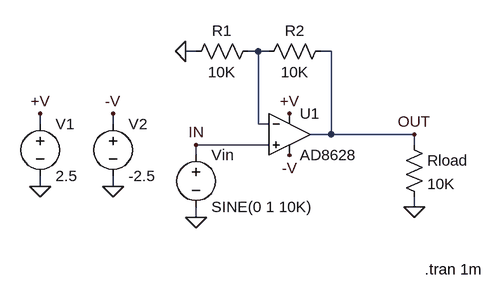
[diagram p0: schematic AD8628.asc]
AD8628.asc, the LTspice schematic file:
Version 4
SHEET 1 1240 700
WIRE -16 -1056 -32 -1056
WIRE 80 -1056 64 -1056
WIRE 96 -1056 80 -1056
WIRE 192 -1056 176 -1056
WIRE -256 -944 -256 -960
WIRE -144 -944 -144 -960
WIRE 80 -944 80 -1056
WIRE 96 -944 80 -944
WIRE 192 -928 192 -1056
WIRE 192 -928 160 -928
WIRE 320 -928 192 -928
WIRE 96 -912 -16 -912
WIRE 320 -912 320 -928
WIRE -16 -896 -16 -912
WIRE -256 -848 -256 -864
WIRE -144 -848 -144 -864
WIRE 320 -816 320 -832
WIRE -16 -800 -16 -816
FLAG -256 -960 +V
FLAG -256 -848 0
FLAG -16 -800 0
FLAG 320 -928 OUT
FLAG -16 -912 IN
FLAG 128 -960 +V
FLAG -144 -960 -V
FLAG 128 -896 -V
FLAG -32 -1056 0
FLAG 320 -816 0
FLAG -144 -848 0
SYMBOL voltage -256 -960 R0
WINDOW 123 0 0 Left 2
WINDOW 39 0 0 Left 2
SYMATTR InstName V1
SYMATTR Value 2.5
SYMBOL voltage -16 -912 R0
WINDOW 123 24 146 Left 2
WINDOW 39 24 125 Left 2
SYMATTR InstName Vin
SYMATTR Value SINE(0 1 10K)
SYMBOL res 80 -1072 R90
WINDOW 0 0 56 VBottom 2
WINDOW 3 32 56 VTop 2
SYMATTR InstName R1
SYMATTR Value 10K
SYMBOL res 192 -1072 R90
WINDOW 0 0 56 VBottom 2
WINDOW 3 32 56 VTop 2
SYMATTR InstName R2
SYMATTR Value 10K
SYMBOL voltage -144 -960 R0
WINDOW 123 24 146 Left 2
WINDOW 39 24 125 Left 2
SYMATTR InstName V2
SYMATTR Value -2.5
SYMBOL res 304 -928 R0
SYMATTR InstName Rload
SYMATTR Value 10K
SYMBOL Opamps\\AD8628 128 -992 R0
SYMATTR InstName U1
TEXT 336 -720 Left 2 !.tran 1m

The netlist it stands for:
* AD8628.asc
V1 +V 0 2.5
Vin IN 0 SINE(0 1 10K)
R1 N001 0 10K
R2 OUT N001 10K
V2 -V 0 -2.5
Rload OUT 0 10K
XU1 IN N001 +V -V OUT AD8628  ; pins In+ In- V+ V- OUT
.tran 1m
.backanno
.end